# EAGLE schematic CAM_BOARD_V1_X v1 (EAGLE 9.7.0)
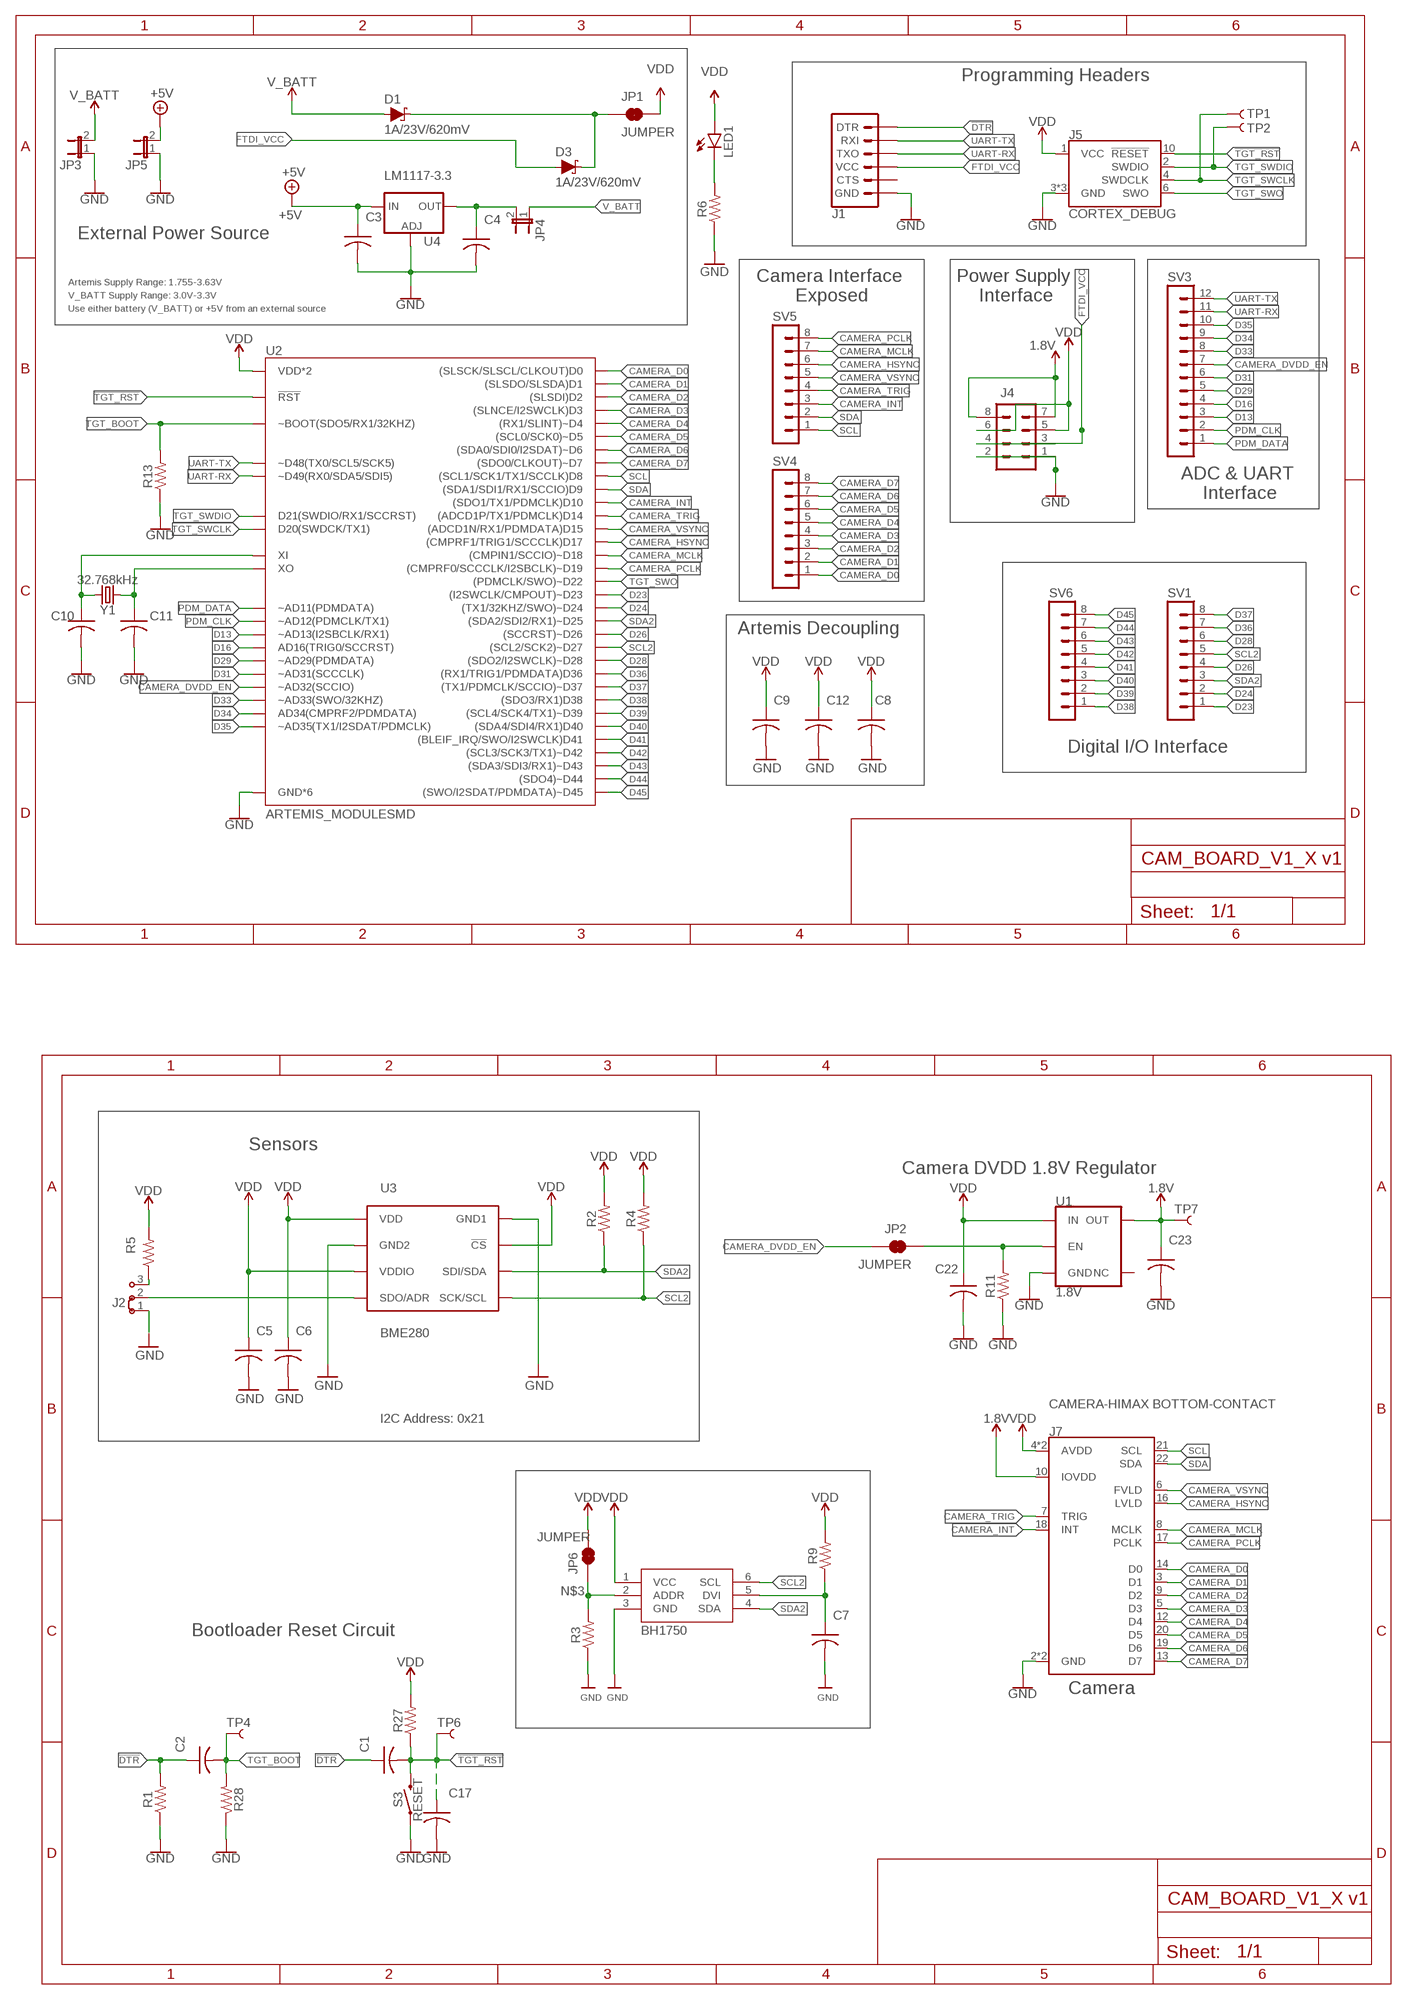
[diagram p0: schematic, sheet 1]

## Parts
C1  0.1uF  C-USC0603  [C0603]
C2  0.1uF  C-USC0603  [C0603]
C3  10uF  C-USC0603  [C0603]
C4  10uF  C-USC0603  [C0603]
C5  0.1uF  C-USC0603  [C0603]
C6  0.1uF  C-USC0603  [C0603]
C7  1uF  C-USC0603  [C0603]
C8  0.1uF  C-USC0603  [C0603]
C9  10uF  C-USC0603  [C0603]
C10  15pF  C-USC0603  [C0603]
C11  15pF  C-USC0603  [C0603]
C12  1.0uF  C-USC0603  [C0603]
C17  1nF  C-USC0603  [C0603]
C22  1.0uF  C-USC0603  [C0603]
C23  1.0uF  C-USC0603  [C0603]
D1  1A/23V/620mV  DIODE-SCHOTTKY-BAT20J  [SOD-323]
D3  1A/23V/620mV  DIODE-SCHOTTKY-BAT20J  [SOD-323]
IC1  BH1750  [WSOF-6]
J1  6_PIN_SERIAL_TARGETSMD  [1X06-SMD_RA_MALE]
J2  J2X2MM  [04C]
J4  MA04-2  [MA04-2]
J5  CORTEX_DEBUG  CORTEX_DEBUG_MINIMUM_PTH  [2X5-PTH-1.27MM]
J7  CAMERA-HIMAX BOTTOM-CONTACT  CAMERA-HIMAXBOTTOM-CONTACT  [FPC-24-AMPHENOL-SFV24R-1STE1HLF]
JP1  JUMPER  JUMPER-COMBO_2_NC_TRACE  [COMBO-JUMPER_2_NC_TRACE]
JP2  JUMPER  JUMPER-COMBO_2_NC_TRACE  [COMBO-JUMPER_2_NC_TRACE]
JP3  JP1E  [JP1]
JP4  JP1E  [JP1]
JP5  JP1E  [JP1]
JP6  JUMPER  JUMPER-COMBO_2_NC_TRACE  [COMBO-JUMPER_2_NC_TRACE]
LED1  LED3MM  [LED3MM]
R1  100k  R-US_R0805  [R0805]
R2  4.7k  R-US_R0805  [R0805]
R3  10k  R-US_R0805  [R0805]
R4  4.7k  R-US_R0805  [R0805]
R5  4.7k  R-US_R0805  [R0805]
R6  10k  R-US_R0805  [R0805]
R9  1k  R-US_R0805  [R0805]
R11  100k  R-US_R0805  [R0805]
R13  10k  R-US_R0805  [R0805]
R27  100k  R-US_R0805  [R0805]
R28  220k  R-US_R0805  [R0805]
S3  RESET  MOMENTARY-SWITCH-SPST-SMD-4.6X2.8MM  [TACTILE_SWITCH_SMD_4.6X2.8MM]
SV1  MA08-1  [MA08-1]
SV3  MA12-1  [MA12-1]
SV4  MA08-1  [MA08-1]
SV5  MA08-1  [MA08-1]
SV6  MA08-1  [MA08-1]
TP1  TEST-POINT3X5  [PAD.03X.05]
TP2  TEST-POINT3X5  [PAD.03X.05]
TP4  TEST-POINT3X5  [PAD.03X.05]
TP6  TEST-POINT3X5  [PAD.03X.05]
TP7  TEST-POINT3X5  [PAD.03X.05]
U1  1.8V  V_REG_AP2127K-1.8V  [SOT23-5]
U2  ARTEMIS_MODULESMD  [ARTEMIS_FP]
U3  BME280  [BME280_LGA]
U4  LM1117-3.3  V_REG_LM1117SOT223  [SOT223]
Y1  32.768kHz  CRYSTAL-32.768KHZSMD-3.2X1.5  [CRYSTAL-SMD-3.2X1.5MM]

## Nets
1.8V: C23.1 J4.7 J4.8 J7.10(IOVDD) TP7.P$1 U1.5(OUT)
!DTR: C1.1 C2.1 J1.1(DTR) R1.2
!TGT_RST: C1.2 C17.1 J5.10(!RESET) R27.1 S3.3 S3.4 TP6.P$1 U2.~RST(!RST)
+5V: JP5.2 U4.3(IN)
CAMERA_D0: J7.14(D0) SV4.1 U2.D0((SLSCK/SLSCL/CLKOUT)D0)
CAMERA_D1: J7.3(D1) SV4.2 U2.D1((SLSDO/SLSDA)D1)
CAMERA_D2: J7.9(D2) SV4.3 U2.D2((SLSDI)D2)
CAMERA_D3: J7.5(D3) SV4.4 U2.D3((SLNCE/I2SWCLK)D3)
CAMERA_D4: J7.12(D4) SV4.5 U2.~D4((RX1/SLINT)~D4)
CAMERA_D5: J7.20(D5) SV4.6 U2.~D5((SCL0/SCK0)~D5)
CAMERA_D6: J7.19(D6) SV4.7 U2.~D6((SDA0/SDI0/I2SDAT)~D6)
CAMERA_D7: J7.13(D7) SV4.8 U2.D7((SDO0/CLKOUT)~D7)
CAMERA_DVDD_EN: JP2.1 JP2.3 SV3.7 U2.~AD32(~AD32(SCCIO))
CAMERA_HSYNC: J7.16(LVLD) SV5.6 U2.D17((CMPRF1/TRIG1/SCCCLK)D17)
CAMERA_INT: J7.18(INT) SV5.3 U2.D10((SDO1/TX1/PDMCLK)D10)
CAMERA_MCLK: J7.8(MCLK) SV5.7 U2.~D18((CMPIN1/SCCIO)~D18)
CAMERA_PCLK: J7.17(PCLK) SV5.8 U2.~D19((CMPRF0/SCCCLK/I2SBCLK)~D19)
CAMERA_TRIG: J7.7(TRIG) SV5.4 U2.D14((ADCD1P/TX1/PDMCLK)D14)
CAMERA_VSYNC: J7.6(FVLD) SV5.5 U2.D15((ADCD1N/RX1/PDMDATA)D15)
D13: SV3.3 U2.~AD13(~AD13(I2SBCLK/RX1))
D16: SV3.4 U2.AD16(AD16(TRIG0/SCCRST))
D23: SV1.1 U2.~D23((I2SWCLK/CMPOUT)~D23)
D24: SV1.2 U2.~D24((TX1/32KHZ/SWO)~D24)
D26: SV1.4 U2.~D26((SCCRST)~D26)
D28: SV1.6 U2.~D28((SDO2/I2SWCLK)~D28)
D29: SV3.5 U2.~AD29(~AD29(PDMDATA))
D31: SV3.6 U2.~AD31(~AD31(SCCCLK))
D33: SV3.8 U2.~AD33/SWO(~AD33(SWO/32KHZ))
D34: SV3.9 U2.AD34(AD34(CMPRF2/PDMDATA))
D35: SV3.10 U2.~AD35(~AD35(TX1/I2SDAT/PDMCLK))
D36: SV1.7 U2.D36((RX1/TRIG1/PDMDATA)D36)
D37: SV1.8 U2.~D37((TX1/PDMCLK/SCCIO)~D37)
D38: SV6.1 U2.D38((SDO3/RX1)D38)
D39: SV6.2 U2.~D39((SCL4/SCK4/TX1)~D39)
D40: SV6.3 U2.D40((SDA4/SDI4/RX1)D40)
D41: SV6.4 U2.D41((BLEIF_IRQ/SWO/I2SWCLK)D41)
D42: SV6.5 U2.~D42((SCL3/SCK3/TX1)~D42)
D43: SV6.6 U2.~D43((SDA3/SDI3/RX1)~D43)
D44: SV6.7 U2.~D44((SDO4)~D44)
D45: SV6.8 U2.~D45((SWO/I2SDAT/PDMDATA)~D45)
FTDI_VCC: D3.A J1.4(VCC) J4.3 J4.4
GND: C3.2 C4.2 C5.2 C6.2 C7.2 C8.2 C9.2 C10.2 C11.2 C12.2 C17.2 C22.2 C23.2 IC1.3(GND) J1.6(GND) J4.1 J4.2 J5.3(GND) J5.5(GND) J5.9(GND) J7.2(GND) J7.15(GND) JP3.1 JP5.1 R1.1 R3.1 R6.1 R11.1 R13.1 R28.1 S3.1 S3.2 U1.2(GND) U2.GND@1(GND*6) U2.GND@22(GND*6) U2.GND@38(GND*6) U2.GND@39(GND*6) U2.GND@47(GND*6) U2.GND@59(GND*6) U3.P$1(GND1) U3.P$7(GND2) U4.1(ADJ)
N$1: JP2.2 JP2.4 R11.2 U1.3(EN)
N$2: C7.1 IC1.5(DVI) R9.1
N$3: IC1.2(ADDR) JP6.1 JP6.3 R3.2
N$4: C4.1 JP4.2 U4.2(OUT) U4.4(OUT)
N$5: J2.3 R5.1
N$7: J2.2 U3.P$5(SDO/ADR)
N$8: C3.1
N$9: LED1.K(C) R6.2
N$14: C10.1 U2.XI Y1.P$2
N$15: C11.1 U2.XO Y1.P$1
PDM_CLK: SV3.2 U2.~AD12(~AD12(PDMCLK/TX1))
PDM_DATA: SV3.1 U2.~AD11(~AD11(PDMDATA))
SCL: J7.21(SCL) SV5.1 U2.D8((SCL1/SCK1/TX1/SCCLK)D8)
SCL1: J2.1
SCL2: IC1.6(SCL) R4.1 SV1.5 U2.~D27((SCL2/SCK2)~D27) U3.P$4(SCK/SCL)
SDA: J7.22(SDA) SV5.2 U2.D9((SDA1/SDI1/RX1/SCCIO)D9)
SDA2: IC1.4(SDA) R2.1 SV1.3 U2.~D25((SDA2/SDI2/RX1)~D25) U3.P$3(SDI/SDA)
TGT_BOOT: C2.2 R13.2 R28.2 TP4.P$1 U2.BOOT(~BOOT(SDO5/RX1/32KHZ))
TGT_SWCLK: J5.4(SWDCLK) TP1.P$1 U2.SWDCK(D20(SWDCK/TX1))
TGT_SWDIO: J5.2(SWDIO) TP2.P$1 U2.SWDIO(D21(SWDIO/RX1/SCCRST))
TGT_SWO: J5.6(SWO) U2.~D22((PDMCLK/SWO)~D22)
UART-RX: J1.3(TXO) SV3.11 U2.RXI-0(~D49(RX0/SDA5/SDI5))
UART-TX: J1.2(RXI) SV3.12 U2.TXO-0(~D48(TX0/SCL5/SCK5))
V_BATT: D1.A JP3.2 JP4.1
VDD: C5.1 C6.1 C8.1 C9.1 C12.1 C22.1 IC1.1(VCC) J4.5 J4.6 J5.1(VCC) J7.4(AVDD) J7.11(AVDD) JP1.2 JP1.4 JP6.2 JP6.4 LED1.A R2.2 R4.2 R5.2 R9.2 R27.2 U1.1(IN) U2.VDD@36(VDD*2) U2.VDD@37(VDD*2) U3.P$2(!CS) U3.P$6(VDDIO) U3.P$8(VDD)
VIN1: D1.C D3.C JP1.1 JP1.3
Unconnected: J1.5(CTS) J7.MNT1@0(MNT1) J7.MNT1@1(MNT1) J7.MNT2@0(MNT2) J7.MNT2@1(MNT2) U1.4(NC)

## Notes on the sheet
- Programming Headers
- External Power Source
- Artemis Supply Range: 1.755-3.63V
- Camera Interface 
  Exposed
- Power Supply 
  Interface
- V_BATT Supply Range: 3.0V-3.3V
- Use either battery (V_BATT) or +5V from an external source
- ADC & UART 
  Interface
- Artemis Decoupling
- Digital I/O Interface
- Sensors
- Camera DVDD 1.8V Regulator
- I2C Address: 0x21
- Bootloader Reset Circuit
- Camera

## Library data of the parts
C1-C12 C17 C22 C23 = rcl:C-US: CAPACITOR, American symbol; SPICEPREFIX: C
D1 D3 = SparkFun-DiscreteSemi:DIODE-SCHOTTKY: Schottky diode A Schottky diode is a semiconductor diode which has a low forward voltage drop and a very fast switching action.; PROD_ID: DIO-11623
IC1 = microbuilder:BH1750
J1 = SparkFun-Connectors:6_PIN_SERIAL_TARGET: 6-pin header connection for use with the "FTDI BASIC" pinout - TARGET SIDE. Also known as "Arduino Serial Program Header". It is used to mate with our FTDI Basic serial programmers using the Arduino IDE. Note, this device has "TARGET" in the name. It is intended to be used on a design that contains a target micro-controller that you wish to program. The "sister" device, named "CABLE" is inteneded to be used on a design that usually lives on the end of your USB cable and prvides the converter chip (FTDI232 or FTDI231x) to commnicate serial RX/TX. You can populate with some of these: Break Away Headers - Straight <https://www.sparkfun.com/products/116> (PRT-00116) For reference (or to suit your programming needs) check out these designs: SparkFun FTDI Basic Breakout - 5V <https://www.sparkfun.com/products/9716> (DEV-09716) SparkFun FTDI Basic Breakout - 3.3V <https://www.sparkfun.com/products/9873> (DEV-09873) SparkFun FTDI SmartBasic <https://www.sparkfun.com/products/12935> (DEV-12935) SparkFun Beefy 3 - FTDI Basic Breakout <https://www.sparkfun.com/products/13746> (DEV-13746); PROD_ID: CONN-08971
J2 = jumper:J2: Jumper switch 2 x 2.5 mm
J4 = con-lstb:MA04-2: PIN HEADER; OC_FARNELL: unknown; OC_NEWARK: unknown
J5 = SparkFun-Connectors:CORTEX_DEBUG_MINIMUM: Cortex Debug Connector - 10 pin Supports JTAG debug, Serial Wire debug, and Serial Wire Viewer. PTH and SMD connector options available. General Connector Information <http://infocenter.arm.com/help/topic/com.arm.doc.faqs/attached/13634/cortex_debug_connectors.pdf> Products: PTH Connector <http://www.digikey.com/product-detail/en/cnc-tech/3220-10-0100-00/1175-1627-ND/3883661> -via Digi-Key SparkFun PSoc <https://www.sparkfun.com/products/13229> SparkFun T <https://www.sparkfun.com/products/13810>
J7 = SparkFun-Connectors:CAMERA-HIMAX; DIGIKEY: 609-4320-2-ND; PROD_ID: CONN-14233
JP1 JP2 JP6 = SparkFun-Jumpers:JUMPER-COMBO_2_NC_TRACE
JP3-JP5 = jumper:JP1E: JUMPER
LED1 = led:LED: LED OSRAM: - CHIPLED LG R971, LG N971, LY N971, LG Q971, LY Q971, LO R971, LY R971 LH N974, LH R974 LS Q976, LO Q976, LY Q976 LO Q996 - Hyper CHIPLED LW Q18S LB Q993, LB Q99A, LB R99A - SideLED LS A670, LO A670, LY A670, LG A670, LP A670 LB A673, LV A673, LT A673, LW A673 LH A674 LY A675 LS A676, LA A676, LO A676, LY A676, LW A676 LS A679, LY A679, LG A679 - Hyper Micro SIDELED® LS Y876, LA Y876, LO Y876, LY Y876 LT Y87S - SmartLED LW L88C, LW L88S LB L89C, LB L89S, LG L890 LS L89K, LO L89K, LY L89K LS L896, LA L896, LO L896, LY L896 - TOPLED LS T670, LO T670, LY T670, LG T670, LP T670 LSG T670, LSP T670, LSY T670, LOP T670, LYG T670 LG T671, LOG T671, LSG T671 LB T673, LV T673, LT T673, LW T673 LH T674 LS T676, LA T676, LO T676, LY T676, LB T676, LH T676, LSB T676, LW T676 LB T67C, LV T67C, LT T67C, LS T67K, LO T67K, LY T67K, LW E67C LS E67B, LA E67B, LO E67B, LY E67B, LB E67C, LV E67C, LT E67C LW T67C LS T679, LY T679, LG T679 LS T770, LO T770, LY T770, LG T770, LP T770 LB T773, LV T773, LT T773, LW T773 LH T774 LS E675, LA E675, LY E675, LS T675 LS T776, LA T776, LO T776, LY T776, LB T776 LHGB T686 LT T68C, LB T68C - Hyper Mini TOPLED® LB M676 - Mini TOPLED Santana® LG M470 LS M47K, LO M47K, LY M47K Source: http://www.osram.convergy.de LUXEON: - LUMILED® LXK2-PW12-R00, LXK2-PW12-S00, LXK2-PW14-U00, LXK2-PW14-V00 LXK2-PM12-R00, LXK2-PM12-S00, LXK2-PM14-U00 LXK2-PE12-Q00, LXK2-PE12-R00, LXK2-PE12-S00, LXK2-PE14-T00, LXK2-PE14-U00 LXK2-PB12-K00, LXK2-PB12-L00, LXK2-PB12-M00, LXK2-PB14-N00, LXK2-PB14-P00, LXK2-PB14-Q00 LXK2-PR12-L00, LXK2-PR12-M00, LXK2-PR14-Q00, LXK2-PR14-R00 LXK2-PD12-Q00, LXK2-PD12-R00, LXK2-PD12-S00 LXK2-PH12-R00, LXK2-PH12-S00 LXK2-PL12-P00, LXK2-PL12-Q00, LXK2-PL12-R00 Source: www.luxeon.com KINGBRIGHT: KA-3528ASYC Source: www.kingbright.com
R1-R6 R9 R11 R13 R27 R28 = rcl:R-US_: RESISTOR, American symbol; SPICEPREFIX: R
S3 = SparkFun-Switches:MOMENTARY-SWITCH-SPST: Momentary Switch (Pushbutton) - SPST Normally-open (NO) SPST momentary switches (buttons, pushbuttons). Variants PTH-12MM - 12mm square, through-hole Momentary Pushbutton Switch - 12mm Square <https://www.sparkfun.com/products/9190> (COM-09190) PTH-6.0MM, PTH-6.0MM-KIT - 6.0mm square, through-hole Mini Pushbutton Switch <https://www.sparkfun.com/products/97> (COM-00097) KIT package intended for soldering kit's - only one side of pads' copper is exposed. PTH-RIGHT-ANGLE-KIT - Right-angle, through-hole Right Angle Tactile Button <https://www.sparkfun.com/products/10791> - Used on SparkFun BigTime Watch Kit <https://www.sparkfun.com/products/11734> SMD-12MM - 12mm square, surface-mount Tactile Button - SMD (12mm) <https://www.sparkfun.com/products/12993> (COM-12993) Used on SparkFun PicoBoard <https://www.sparkfun.com/products/11888> SMD-4.5MM - 4.5mm Square Trackball Switch Used on SparkFun Blackberry Trackballer Breakout <https://www.sparkfun.com/products/13169> SMD-4.6MMX2.8MM - 4.60mm x 2.80mm, surface mount Used on SparkFun SAMD21 Mini Breakout <https://www.sparkfun.com/products/13664> SMD-5.2MM, SMD-5.2-REDUNDANT - 5.2mm square, surface-mount Mini Pushbutton Switch - SMD <https://www.sparkfun.com/products/8720> (COM-08720) Used on Arduino Pro Mini <https://www.sparkfun.com/products/11114> REDUNDANT package connects both switch circuits together SMD-6.0X3.5MM - 6.0 x 3.5mm, surface mount Momentary Reset Switch SMD <https://www.sparkfun.com/products/8229> (COM-08229) SMD-6.2MM-TALL - 6.2mm square, surface mount Tactile Button - SMD (6mm) <https://www.sparkfun.com/products/12992> Used on SparkFun Digital Sandbox <https://www.sparkfun.com/products/12651> SMD-RIGHT-ANGLE - Right-angle, surface mount Used on SparkFun Block for Intel® Edison - Arduino <https://www.sparkfun.com/products/13036>; PROD_ID: SWCH-13065
SV1 SV4-SV6 = con-lstb:MA08-1: PIN HEADER; OC_FARNELL: unknown; OC_NEWARK: unknown
SV3 = con-lstb:MA12-1: PIN HEADER; OC_FARNELL: unknown; OC_NEWARK: unknown
TP1 TP2 TP4 TP6 TP7 = SparkFun-Connectors:TEST-POINT: SparkFun Test Points Bare copper test points for troubleshooting or In-Circuit-Testing. These are used by our Production team for verifying production board runs using pogo-pins on test beds. SparkFun Products: SparkFun LSM9DS1 Breakout <https://www.sparkfun.com/products/13284> SparkFun PSOC <https://www.sparkfun.com/products/13714> SparkFun Load Cell Amplifier <https://www.sparkfun.com/products/13879>
U1 = SparkFun-IC-Power:V_REG_AP2127: AP2127 - 300mA CMOS LDO Regulator w/ Enable The AP2127 is CMOS process low dropout linear regulator with enable function, the regulator delivers a guaranteed 300mA (min.) continuous load current. Features Output Voltage Accuracy: ±1.5% Output Current: 300mA (Min.) Foldback Short Current Protection: 50mA Enable Function to Turn ON/OFF VOUT Low Dropout Voltage (3.3V): 250mV (Typ.) @IOUT=600mA Excellent Load Regulation: 0.2%/A (Typ.) Excellent Line Regulation: 0.02%/V (Typ.) Low Quiescent Current: 55μA (Typ.) Low Standby Current: 0.01μA (Typ.) Low Output Noise: 50μVRMS PSRR: 100Hz -65dB, 1kHz -65dB OTSD Protection Stable with 1.0μF Flexible Cap: Ceramic, Tantalum and Aluminum Electrolytic Operation Temperature Range: -40°C to 85°C ESD: MM 400V, HBM 4000V; PROD_ID: VREG-14239
U2 = SparkFun-IC-Microcontroller:ARTEMIS_MODULE: Description: The Artemis Module from SparkFun is a Cortex-M4F with BLE 5.0 running up to 96MHz and with as low power as 6uA per MHz (less than 5mW). This is the world's first module to bridge the market between hobbyists and consumer products. We've packaged all the power of a modern microcontroller into a module that is both extremely easy to use but is mass-market ready. The flexibility of the Artemis module starts with our [Arduino core](https://github.com/sparkfun/Arduino_Apollo3). You can program and use the Artemis module just like you would an Uno or any other Arduino. Time to first blink is just 5 minutes away! We built the core from the ground up, making it fast and as light weight as possible.; PROD_ID: SUB-14479
U3 = BME280ComponentLibrary:BME280; PROD_ID: IC-13090
U4 = SparkFun-IC-Power:V_REG_LM1117: Voltage Regulator LM1117 Standard adjustable voltage regulator but in SMD form. Spark Fun Electronics SKU : COM-00595; PROD_ID: VREG-08170
Y1 = SparkFun-Clocks:CRYSTAL-32.768KHZ: 32.768kHz Crystal Frequency: 32.768kHz Frequency Stability: ±20ppm Load Capacitance: 12.5pF (PTH-2X6 & SMD-3.2X1.5), 6pF (SMD-2X6) SparkFun Products: SparkFun BigTime Watch Kit <https://www.sparkfun.com/products/11734> SparkFun nRF52832 Breakout <https://www.sparkfun.com/products/13990> SparkFun Real Time Clock Module <https://www.sparkfun.com/products/12708>; PROD_ID: XTAL-13062